# EAGLE design gcsc_ii (EAGLE 6.6.0)
DATABASE: C:\projects\common\EagleCad\ulp\PARTSDB.txt
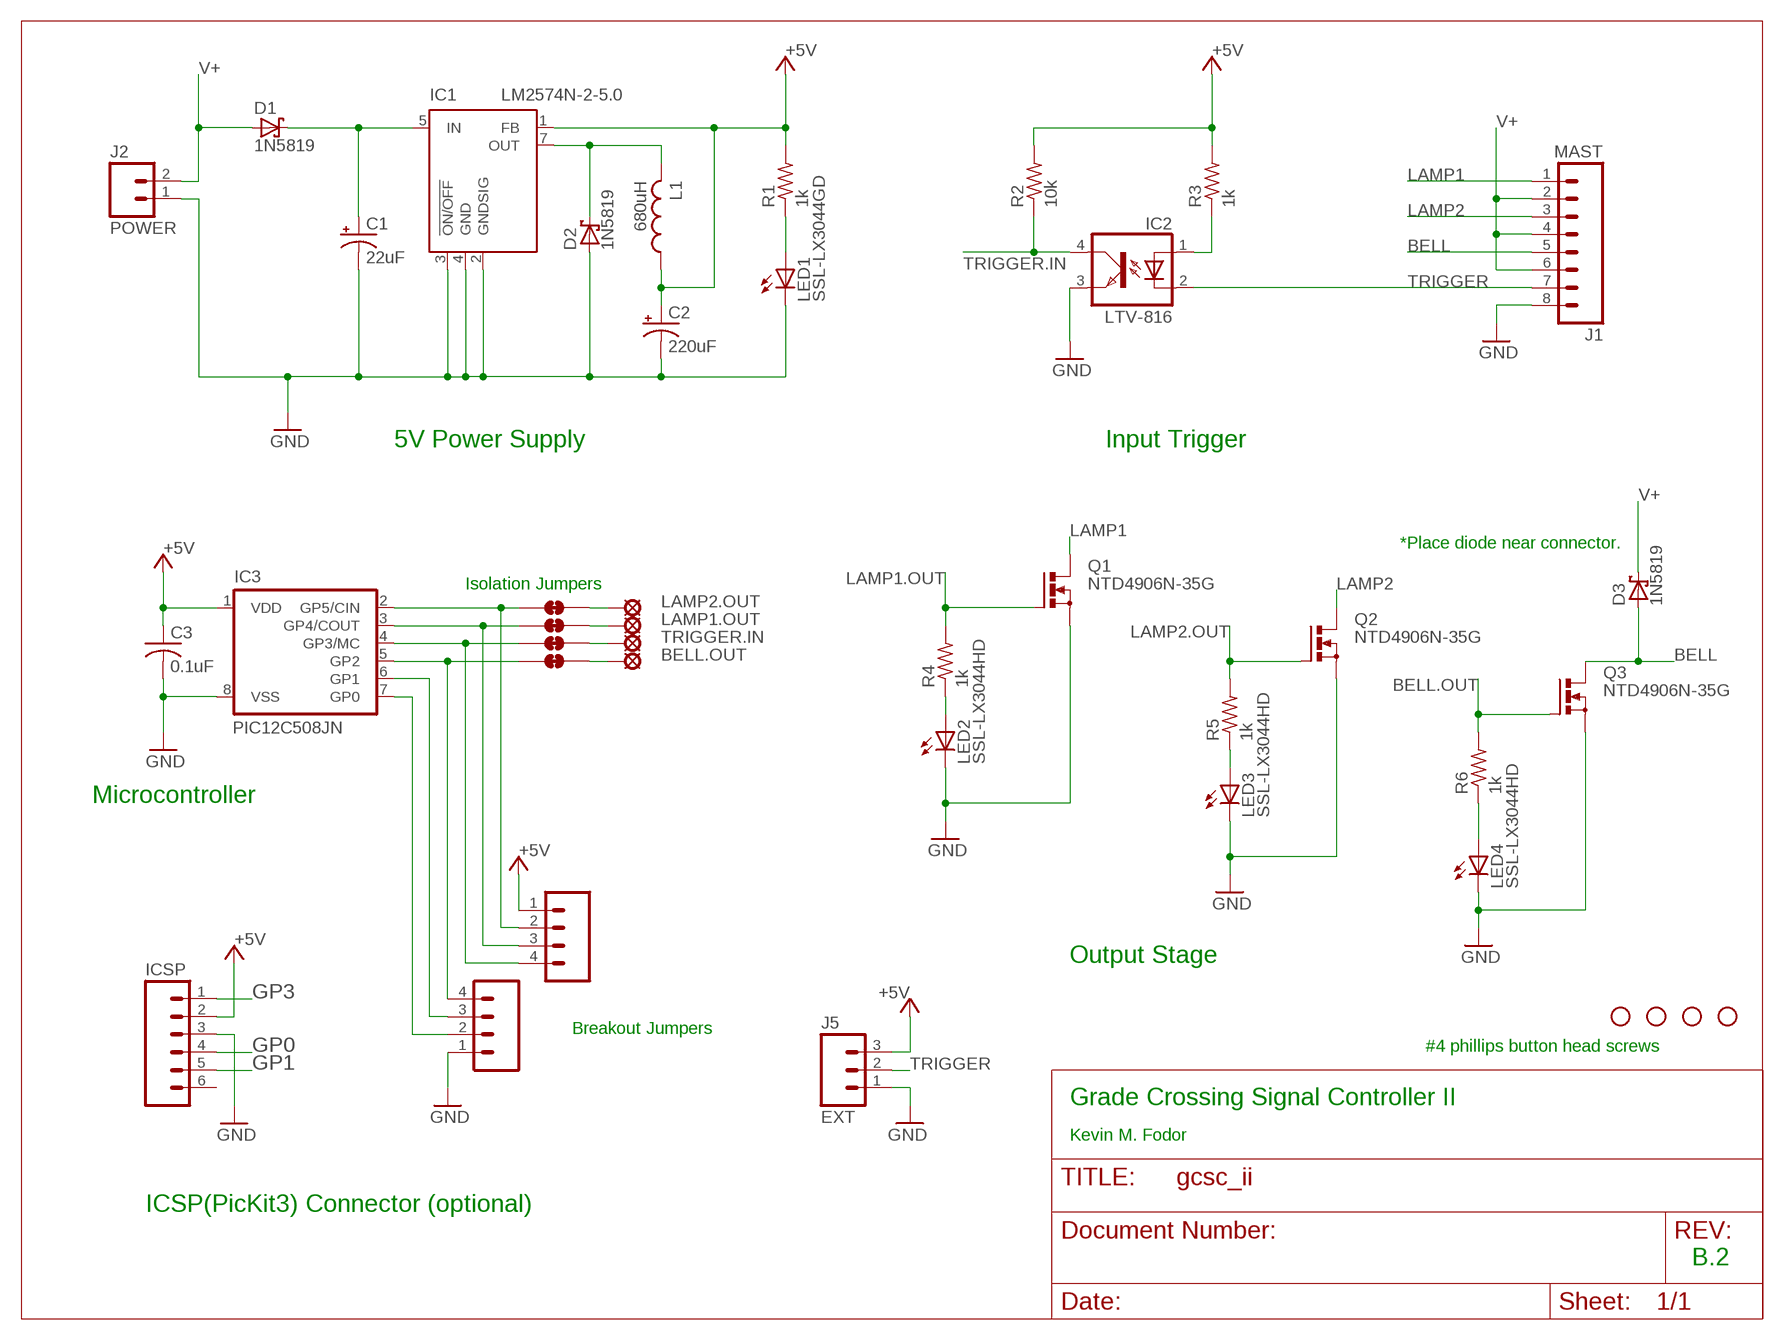
[diagram p0: schematic, sheet 1]

## Parts
BELL.OUT  BELL  LSP10  [LSP10]
C1  22uF  CPOL-USFR-5  [E2-5]
C2  220uF  CPOL-USFR-6,3  [E2,5-6,3]
C3  0.1uF  C-USC025-024X044  [C025-024X044]
D1  1N5819  SCHOTTKY-DIODEDO41  [DO41-10]
D2  1N5819  SCHOTTKY-DIODEDO41  [DO41-10]
D3  1N5819  SCHOTTKY-DIODEDO41  [DO41-10]
GP2  GP2  SJ_CLOSED  [SJ_2S-TRACE]
GP3  GP3  SJ_CLOSED  [SJ_2S-TRACE]
GP4  GP4  SJ_CLOSED  [SJ_2S-TRACE]
GP5  GP5  SJ_CLOSED  [SJ_2S-TRACE]
IC1  LM2574N-2-5.0  [DIL8]
IC2  LTV-816  LTV816  [DIL04]
IC3  PIC12C508JN  [DIL8]
ICSP  PIC_ICSP_RA  [PIC_ICSP]
J1  MAST  KK-156-8-RA  [KK-156-8-RA]
J2  POWER  KK-156-2RA  [KK-156-2-RA]
J3  IC3_1-4  M04LOCK  [1X04_LOCK]
J4  IC3_5-8  M04LOCK  [1X04_LOCK]
J5  EXT  M03POLAR_LOCK  [MOLEX-1X3_LOCK]
L1  680uH  RLB0608  [RLB0608]
LAMP1.OUT  LAMP1  LSP10  [LSP10]
LAMP2.OUT  LAMP2  LSP10  [LSP10]
LED1  SSL-LX3044GD  LED3MM  [LED3MM]
LED2  SSL-LX3044HD  LED3MM  [LED3MM]
LED3  SSL-LX3044HD  LED3MM  [LED3MM]
LED4  SSL-LX3044HD  LED3MM  [LED3MM]
Q1  NTD4906N-35G  NTD4906N  [I-PAK_STRAIGHT_LEAD]
Q2  NTD4906N-35G  NTD4906N  [I-PAK_STRAIGHT_LEAD]
Q3  NTD4906N-35G  NTD4906N  [I-PAK_STRAIGHT_LEAD]
R1  1k  R-US0207/10  [0207/10]
R2  10k  R-US0207/10  [0207/10]
R3  1k  R-US0207/10  [0207/10]
R4  1k  R-US0207/10  [0207/10]
R5  1k  R-US0207/10  [0207/10]
R6  1k  R-US0207/10  [0207/10]
TRIGGER.IN  TRIGGER  LSP10  [LSP10]
U$1  STAND-OFF  [STAND-OFF]
U$2  STAND-OFF  [STAND-OFF]
U$3  STAND-OFF  [STAND-OFF]
U$4  STAND-OFF  [STAND-OFF]

## Nets
+5V [VCC]: C2.+ C3.1 IC1.1(FB) IC3.1(VDD) ICSP.2(VDD) J3.1 J5.3 L1.1 R1.2 R2.2 R3.2
BELL [BATTERY]: D3.A J1.5 Q3.2(D)
BELL.OUT: BELL.OUT.MP GP2.2 Q3.1(G) R6.2
GND: C1.- C2.- C3.2 D2.A IC1.2(GNDSIG) IC1.3(!ON/OFF) IC1.4(GND) IC2.3(EMIT) IC3.8(VSS) ICSP.3(VSS) J1.8 J2.1 J4.1 J5.1 LED1.K(C) LED2.K(C) LED3.K(C) LED4.K(C) Q1.3(S) Q2.3(S) Q3.3(S)
GP0: IC3.7(GP0) ICSP.4(ICSPDAT) J4.2
GP1: IC3.6(GP1) ICSP.5(ICSPCLK) J4.3
GP2: GP2.1 IC3.5(GP2) J4.4
GP3: GP3.1 IC3.4(GP3/MC) ICSP.1(!MCLR) J3.4
GP4: GP4.1 IC3.3(GP4/COUT) J3.3
GP5: GP5.1 IC3.2(GP5/CIN) J3.2
LAMP1 [BATTERY]: J1.1 Q1.2(D)
LAMP1.OUT: GP4.2 LAMP1.OUT.MP Q1.1(G) R4.2
LAMP2 [BATTERY]: J1.3 Q2.2(D)
LAMP2.OUT: GP5.2 LAMP2.OUT.MP Q2.1(G) R5.2
N$1: IC2.1(A) R3.1
N$2: LED1.A R1.1
N$3 [VCC]: C1.+ D1.C IC1.5(IN)
N$4 [VCC]: D2.C IC1.7(OUT) L1.2
N$5: LED2.A R4.1
N$6: LED3.A R5.1
N$7: LED4.A R6.1
TRIGGER: IC2.2(C) J1.7 J5.2
TRIGGER.IN: GP3.2 IC2.4(COL) R2.1 TRIGGER.IN.MP
V+ [BATTERY]: D1.A D3.C J1.2 J1.4 J1.6 J2.2
Unconnected: ICSP.6(NC)

## Notes on the sheet
- 5V Power Supply | Input Trigger
- *Place diode near connector.
- Isolation Jumpers
- Microcontroller
- Output Stage
- Breakout Jumpers
- #4 phillips button head screws
- Grade Crossing Signal Controller II
- Kevin M. Fodor
- ICSP(PicKit3) Connector (optional)
- B.2

## Library data of the parts
BELL.OUT LAMP1.OUT LAMP2.OUT TRIGGER.IN = kevin:LSP10: SOLDER PAD drill 1.0 mm, distributor Buerklin, 12H555; BOM: EXCLUDE; DNP: T; PARTNO: 22-28-4012
C1 = kevin:CPOL-US: POLARIZED CAPACITOR, American symbol; PARTNO: EEU-FR1H220
C2 = kevin:CPOL-US: POLARIZED CAPACITOR, American symbol; PARTNO: EEU-FR1C221
C3 = kevin:C-US: CAPACITOR, American symbol; PARTNO: 21RZ310-RC
D1-D3 = kevin:SCHOTTKY-DIODE: Schottky Diode; PARTNO: 1N5819
GP2-GP5 = kevin:SJ_CLOSED: Jumper - CLOSED; BOM: EXCLUDE; DNP: T
IC1 = kevin:LM2574?-*: SIMPLE SWITCHER 0.5A Step-Down Voltage Regulator Source: http://cache.national.com/ds/LM/LM2574.pdf; PARTNO: LM2574N-5G
IC2 = kevin:LTV816: OPTO COUPLER Source: LITEON, LTV816.pdf; OC_FARNELL: unknown; OC_NEWARK: unknown; PARTNO: LTV-816
IC3 = kevin:PIC12C*?: MICROCONTROLLER; MF: MICROCHIP; MPN: PIC12C508-04/P; OC_FARNELL: 9758771; OC_NEWARK: 60K6710; PARTNO: PIC12F508-I/P
ICSP = kevin:PIC_ICSP: Microchip PicKit3 ICSP/ICD Header; BOM: EXCLUDE; DNP: T; PARTNO: 68016-106HLF
J1 = kevin:KK-156-8: KK 156 HEADER Molex 26-60-5080 Source: http://www.molex.com/pdm_docs/sd/026604100_sd.pdf; PARTNO: 26-60-5080
J2 = kevin:KK-156-2: KK 156 HEADER Source: http://www.molex.com/pdm_docs/sd/026604100_sd.pdf; PARTNO: 26-60-5020
J3 J4 = kevin:M04: Header 4 Standard 4-pin 0.1" header. Use with straight break away headers (SKU : PRT-00116), right angle break away headers (PRT-00553), swiss pins (PRT-00743), machine pins (PRT-00117), and female headers (PRT-00115). Molex polarized connector foot print use with SKU : PRT-08231 with associated crimp pins and housings.; BOM: EXCLUDE; DNP: T; PARTNO: 22-28-4042
J5 = kevin:M03: Header 3 Standard 3-pin 0.1" header. Use with straight break away headers (SKU : PRT-00116), right angle break away headers (PRT-00553), swiss pins (PRT-00743), machine pins (PRT-00117), and female headers (PRT-00115). Molex polarized connector foot print use with SKU : PRT-08232 with associated crimp pins and housings.; BOM: INCLUDE; DNP: F; PARTNO: 22-27-2031
L1 = kevin:RLB0608; PARTNO: RLB0608-681KL
LED1 = kevin:LED: LED OSRAM: - CHIPLED LG R971, LG N971, LY N971, LG Q971, LY Q971, LO R971, LY R971 LH N974, LH R974 LS Q976, LO Q976, LY Q976 LO Q996 - Hyper CHIPLED LW Q18S LB Q993, LB Q99A, LB R99A - SideLED LS A670, LO A670, LY A670, LG A670, LP A670 LB A673, LV A673, LT A673, LW A673 LH A674 LY A675 LS A676, LA A676, LO A676, LY A676, LW A676 LS A679, LY A679, LG A679 - Hyper Micro SIDELED® LS Y876, LA Y876, LO Y876, LY Y876 LT Y87S - SmartLED LW L88C, LW L88S LB L89C, LB L89S, LG L890 LS L89K, LO L89K, LY L89K LS L896, LA L896, LO L896, LY L896 - TOPLED LS T670, LO T670, LY T670, LG T670, LP T670 LSG T670, LSP T670, LSY T670, LOP T670, LYG T670 LG T671, LOG T671, LSG T671 LB T673, LV T673, LT T673, LW T673 LH T674 LS T676, LA T676, LO T676, LY T676, LB T676, LH T676, LSB T676, LW T676 LB T67C, LV T67C, LT T67C, LS T67K, LO T67K, LY T67K, LW E67C LS E67B, LA E67B, LO E67B, LY E67B, LB E67C, LV E67C, LT E67C LW T67C LS T679, LY T679, LG T679 LS T770, LO T770, LY T770, LG T770, LP T770 LB T773, LV T773, LT T773, LW T773 LH T774 LS E675, LA E675, LY E675, LS T675 LS T776, LA T776, LO T776, LY T776, LB T776 LHGB T686 LT T68C, LB T68C - Hyper Mini TOPLED® LB M676 - Mini TOPLED Santana® LG M470 LS M47K, LO M47K, LY M47K Source: http://www.osram.convergy.de/; PARTNO: SSL-LX3044GD
LED2-LED4 = kevin:LED: LED OSRAM: - CHIPLED LG R971, LG N971, LY N971, LG Q971, LY Q971, LO R971, LY R971 LH N974, LH R974 LS Q976, LO Q976, LY Q976 LO Q996 - Hyper CHIPLED LW Q18S LB Q993, LB Q99A, LB R99A - SideLED LS A670, LO A670, LY A670, LG A670, LP A670 LB A673, LV A673, LT A673, LW A673 LH A674 LY A675 LS A676, LA A676, LO A676, LY A676, LW A676 LS A679, LY A679, LG A679 - Hyper Micro SIDELED® LS Y876, LA Y876, LO Y876, LY Y876 LT Y87S - SmartLED LW L88C, LW L88S LB L89C, LB L89S, LG L890 LS L89K, LO L89K, LY L89K LS L896, LA L896, LO L896, LY L896 - TOPLED LS T670, LO T670, LY T670, LG T670, LP T670 LSG T670, LSP T670, LSY T670, LOP T670, LYG T670 LG T671, LOG T671, LSG T671 LB T673, LV T673, LT T673, LW T673 LH T674 LS T676, LA T676, LO T676, LY T676, LB T676, LH T676, LSB T676, LW T676 LB T67C, LV T67C, LT T67C, LS T67K, LO T67K, LY T67K, LW E67C LS E67B, LA E67B, LO E67B, LY E67B, LB E67C, LV E67C, LT E67C LW T67C LS T679, LY T679, LG T679 LS T770, LO T770, LY T770, LG T770, LP T770 LB T773, LV T773, LT T773, LW T773 LH T774 LS E675, LA E675, LY E675, LS T675 LS T776, LA T776, LO T776, LY T776, LB T776 LHGB T686 LT T68C, LB T68C - Hyper Mini TOPLED® LB M676 - Mini TOPLED Santana® LG M470 LS M47K, LO M47K, LY M47K Source: http://www.osram.convergy.de/; PARTNO: SSL-LX3044HD
Q1-Q3 = kevin:NTD4906N: N-CHANNEL MOS FET; PARTNO: NTD4906N-35G
R1 R3-R6 = kevin:R-US; PARTNO: 299-1K-RC
R2 = kevin:R-US; PARTNO: 299-10K-RC
U$1-U$4 = kevin:STAND-OFF: Stand Off This is the mechanical footprint for a #4 phillips button head screw. Use the keepout ring to avoid running the screw head into surrounding components. SKU : PRT-00447; BOM: EXCLUDE

## Net classes
0 default: width 0.203 mm, clearance 0.203 mm
1 VCC: width 0.508 mm, clearance 0.203 mm
2 BATTERY: width 1.27 mm, clearance 0.508 mm

## Board
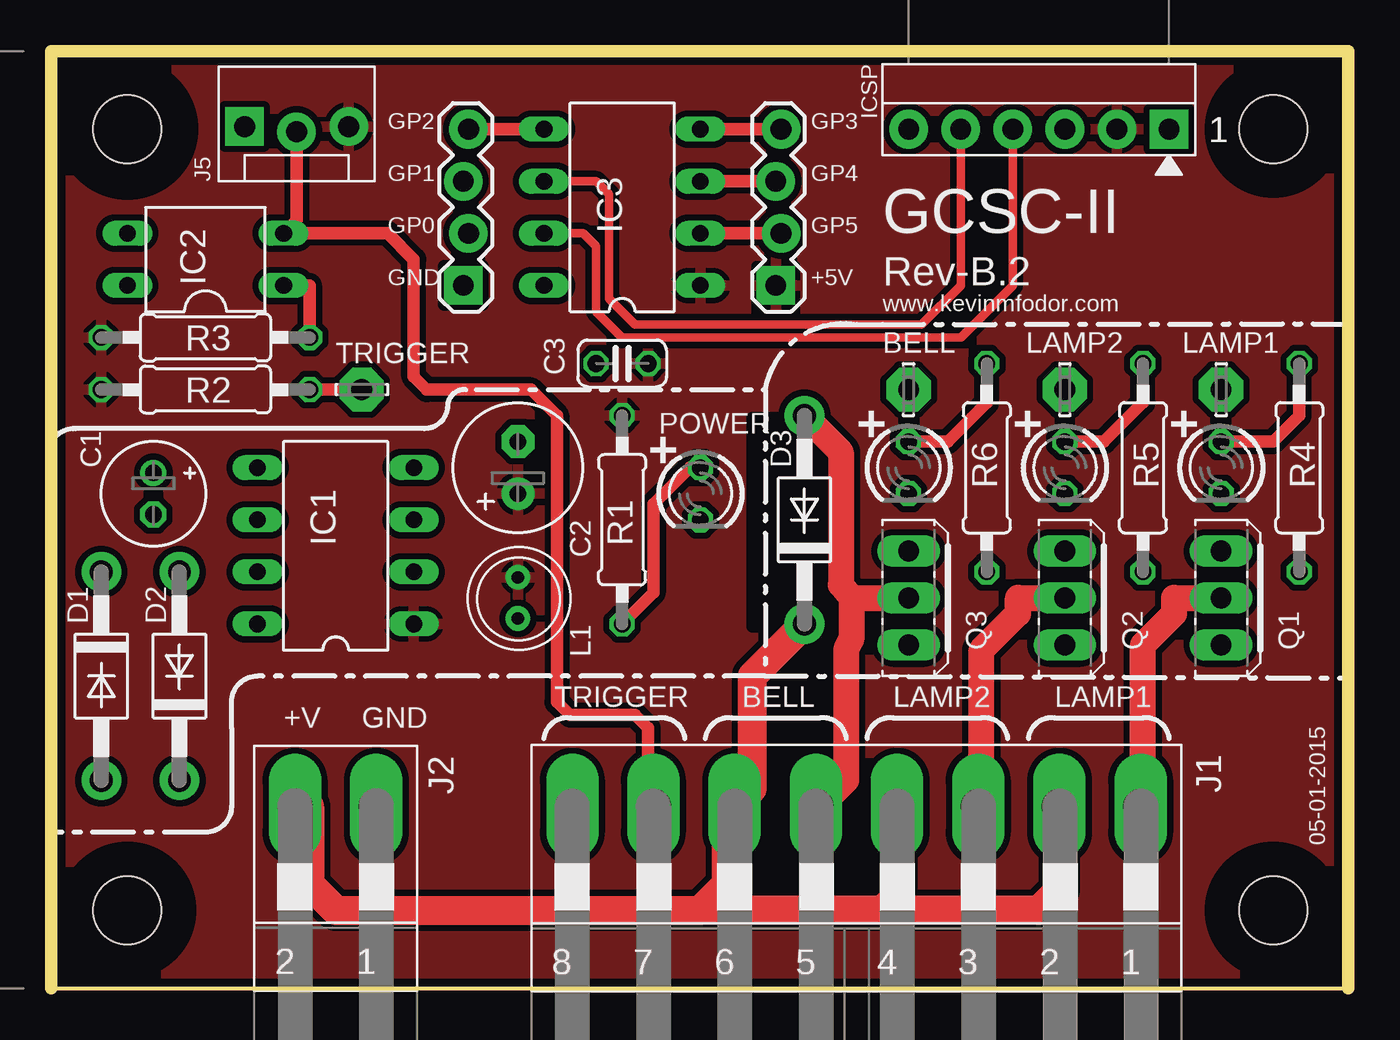
[diagram p1: board, top side]
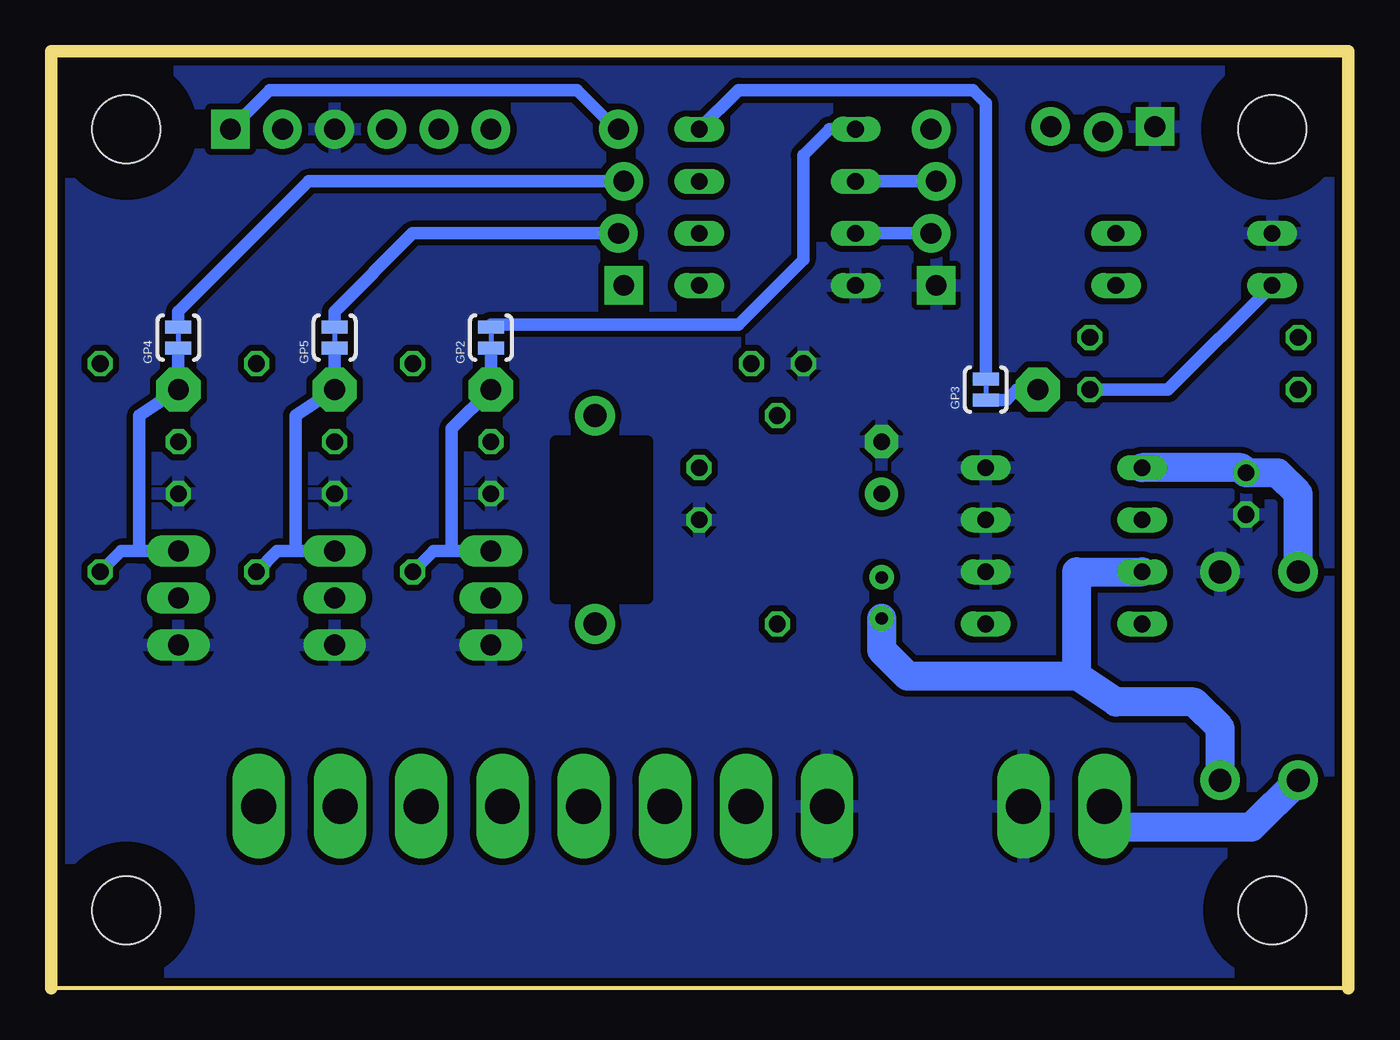
[diagram p2: board, bottom side, seen from below]

Size 63.25 x 45.71 mm. Coordinates in mm from the lower left corner, seen from the top.
Outline: 0,0 63.25,0 63.25,45.71 0,45.71 0,0
Copper layers (1*16): Top 0.0356mm / dielectric 1.5011mm / Bottom 0.0356mm
Design rules "LaenPCBOrder": minimum track width 6mil, minimum drill 13mil, track to track 6mil, track to pad 6mil, pad to pad 6mil, via to via 6mil, smd to smd 6mil, copper to edge 15mil, drill to drill 6mil, minimum pad ring 7mil, minimum via ring 7mil, stop-mask expansion 4mil, vias tented up to drill 0mil, thermal gap 10mil
tRestrict: area 0.9,1 to 6.5,6.6; area 56.7,39.1 to 62.4,44.7; area 56.7,1 to 62.4,6.6; area 0.9,39.1 to 6.5,44.7; area 35.2,18.8 to 37.4,26.3; area 34.2,17.7 to 35.2,27.8
bRestrict: area 56.7,39.1 to 62.4,44.7; area 56.7,1 to 62.4,6.6; area 0.9,1 to 6.5,6.6; area 0.9,39.1 to 6.5,44.7; area 34.2,19 to 38.6,26.7

### Footprints (pad centres in the part's own frame; a part is rotated, then mirrored left to right if it is on the bottom)
LSP10 = drill 1.016 pad 2.159 octagon: MP 0,0
E2-5 = drill 0.813 pad 1.27: + -1.016,0 | drill 0.813 pad 1.27 octagon: - 1.016,0
E2,5-6,3 = drill 0.813 pad 1.6: + -1.27,0 | drill 0.813 pad 1.6 octagon: - 1.27,0
C025-024X044 = drill 0.813 octagon: 1 -1.27,0; 2 1.27,0
DO41-10 = drill 1.118 pad 1.93: A 5.08,0; C -5.08,0
SJ_2S-TRACE = smd 0.635 x 1.27: 1 -0.508,0; 2 0.508,0
DIL8 = drill 0.813 long: 1 -3.81,-3.81; 2 -1.27,-3.81; 3 1.27,-3.81; 4 3.81,-3.81; 5 3.81,3.81; 6 1.27,3.81; 7 -1.27,3.81; 8 -3.81,3.81
DIL04 = drill 0.813 long: 1 -1.27,-3.81; 2 1.27,-3.81; 3 1.27,3.81; 4 -1.27,3.81
PIC_ICSP = drill 1.016 pad 1.88 square: 1 12.7,0 | drill 1.016 pad 1.88: 2 10.16,0; 3 7.62,0; 4 5.08,0; 5 2.54,0; 6 0,0
KK-156-8-RA = drill 1.7 long: 1 -13.86,0; 2 -9.9,0; 3 -5.94,0; 4 -1.98,0; 5 1.98,0; 6 5.94,0; 7 9.9,0; 8 13.86,0
KK-156-2-RA = drill 1.7 long: 1 -1.98,0; 2 1.98,0
1X04_LOCK = drill 1.016 pad 1.88 square: 1 0,0.127 | drill 1.016 pad 1.88: 2 2.54,-0.127; 3 5.08,0.127; 4 7.62,-0.127
MOLEX-1X3_LOCK = drill 1.016 pad 1.88 square: 1 0,0.127 | drill 1.016 pad 1.88: 2 2.54,-0.127; 3 5.08,0.127
RLB0608 = drill 0.6 pad 1.2: 1 -1,0; 2 1,0
LED3MM = drill 0.813 octagon: A -1.27,0; K 1.27,0
I-PAK_STRAIGHT_LEAD = drill 1.016 long: 1 -2.286,0; 2 0,0; 3 2.286,0
0207/10 = drill 0.813 octagon: 1 -5.08,0; 2 5.08,0
STAND-OFF = hole 3.302: 0,0

### Placement (x,y rotation side)
BELL.OUT  41.81,29.21 90 top
C1  4.98,24.13 270 top
C2  22.76,25.4 90 top
C3  27.84,30.48 180 top
D1  2.44,15.24 270 top
D2  6.25,15.24 90 top
D3  36.73,22.86 90 top
GP2  41.81,31.75 270 bottom
GP3  17.68,29.21 270 bottom
GP4  57.05,31.75 270 bottom
GP5  49.43,31.75 270 bottom
IC1  13.87,21.59 90 top
IC2  7.52,35.56 90 top
IC3  27.84,38.1 90 top
ICSP  41.81,41.91 0 top
J1  39.27,8.89 180 top
J2  13.87,8.89 180 top
J3  35.46,34.29 90 top
J4  20.22,34.29 90 top
J5  9.42,41.91 0 top
L1  22.76,19.05 270 top
LAMP1.OUT  57.05,29.21 90 top
LAMP2.OUT  49.43,29.21 90 top
LED1  31.65,24.13 270 top
LED2  57.05,25.4 270 top
LED3  49.43,25.4 270 top
LED4  41.81,25.4 270 top
Q1  57.05,19.05 270 top
Q2  49.43,19.05 270 top
Q3  41.81,19.05 270 top
R1  27.84,22.86 90 top
R2  7.52,29.21 180 top
R3  7.52,31.75 180 top
R4  60.86,25.4 270 top
R5  53.24,25.4 270 top
R6  45.62,25.4 270 top
TRIGGER.IN  15.14,29.21 0 top
U$1  3.71,41.91 0 top
U$2  59.59,3.81 0 top
U$3  3.71,3.81 0 top
U$4  59.59,41.91 0 top

### Tracks (layer width: path | path; a pad name or v marks a point on that pad's centre or on a via)
+5V
  pour Top (isolate 0.305): -0.1,0 -0.1,45.72 63.4,45.72 63.4,0
BELL
  Top 1.27: 39.01,19.05 38.51,19.68 38.51,26.16 D3.A | 39.01,19.05 Q3.2 | 39.01,19.05 39.01,17.02 38.76,16.51 38.76,10.16 37.49,8.89 J1.5
BELL.OUT
  Bottom 0.61: GP2.2 BELL.OUT.MP 43.71,27.3 43.71,21.34 | R6.2 44.6,21.34 43.71,21.34 | 43.71,21.34 Q3.1
GND
  pour Bottom (isolate 0.305): -0.1,0 -0.1,45.72 63.4,45.72 63.4,0
GP0
  Top 0.406: ICSP.4 46.89,34.29 44.35,31.75 27.84,31.75 26.57,33.02 26.57,36.2 25.93,36.83 IC3.7
  Bottom 0.61: J4.2 IC3.7
GP1
  Top 0.406: ICSP.5 44.35,34.29 42.44,32.38 28.47,32.38 27.2,33.66 27.2,38.73 26.57,39.37 IC3.6
  Bottom 0.61: J4.3 IC3.6
GP2
  Top 0.61: IC3.5 J4.4
  Bottom 0.61: GP2.1 41.81,32.38 29.74,32.38 26.57,35.56 26.57,40.64 25.3,41.91 IC3.5
GP3
  Top 0.203: 35.46,41.91 J3.4
  Top 0.61: IC3.4 35.46,41.91
  Bottom 0.61: GP3.1 17.68,43.18 18.31,43.81 29.74,43.81 IC3.4 | ICSP.1 52.6,43.81 37.62,43.81 35.71,41.91 J3.4
GP4
  Top 0.203: 35.2,39.37 J3.3
  Top 0.61: 35.2,39.37 IC3.3
  Bottom 0.61: GP4.1 57.05,33.02 50.7,39.37 35.46,39.37 J3.3
GP5
  Top 0.203: 35.46,36.83 J3.2
  Top 0.61: 35.46,36.83 IC3.2
  Bottom 0.61: J3.2 45.62,36.83 49.43,33.02 GP5.1
LAMP1
  Top 1.27: Q1.2 54.76,19.05 54.76,18.29 53.24,16.76 53.24,8.89 J1.1
LAMP1.OUT
  Bottom 0.61: GP4.2 LAMP1.OUT.MP 58.95,27.94 58.95,21.34 | R4.2 59.84,21.34 58.95,21.34 | 58.95,21.34 Q1.1
LAMP2
  Top 1.27: Q2.2 47.14,19.05 47.14,18.29 45.36,16.51 45.36,8.89 J1.3
LAMP2.OUT
  Bottom 0.61: R5.2 52.22,21.34 51.33,21.34 | Q2.1 51.33,21.34 | 51.33,21.34 51.33,27.94 LAMP2.OUT.MP GP5.2
N$1
  Top 0.61: IC2.1 12.6,34.29 R3.1
N$2
  Top 0.61: R1.1 29.36,19.3 29.36,23.62 31.14,25.4 LED1.A
N$3
  Bottom 1.422: D1.C 2.44,22.86 2.44,24.13 3.45,25.15 C1.+ 5.23,25.4 IC1.5
N$4
  Bottom 1.422: L1.2 22.76,16.51 21.49,15.24 13.23,15.24 | 13.23,15.24 13.23,20.32 IC1.7 | D2.C 6.25,12.7 7.52,13.97 11.33,13.97 13.23,15.24
N$5
  Top 0.61: LED2.A 59.59,26.67 60.86,27.94 R4.1
N$6
  Top 0.61: LED3.A 51.33,26.67 53.24,28.57 R5.1
N$7
  Top 0.61: LED4.A 43.71,26.67 45.62,28.57 R6.1
TRIGGER
  Top 0.61: J5.2 11.96,37.47 IC2.2 16.41,36.83 17.68,35.56 17.68,29.84 18.31,29.21 23.39,29.21 24.66,27.94 24.66,13.97 25.3,13.34 28.47,13.34 29.11,12.7 29.11,9.53 J1.7
TRIGGER.IN
  Top 0.61: R2.1 TRIGGER.IN.MP
  Bottom 0.61: GP3.2 16.66,28.7 16.15,29.21 TRIGGER.IN.MP | IC2.4 8.79,29.21 R2.1
V+
  Top 1.422: J2.2 12.6,8.89 12.6,6.35 12.6,5.08 13.87,3.81 31.65,3.81 | 31.65,3.81 32.92,5.08 32.92,8.48 J1.6 34.19,9.75 34.19,15.24 D3.C | J1.4 41.25,4.52 40.54,3.81 | 40.54,3.81 31.65,3.81 | J1.2 49.17,4.82 48.16,3.81 40.54,3.81
  Bottom 1.27: 10.82,7.87 11.84,8.89 J2.2
  Bottom 1.422: D1.A 4.72,7.87 10.82,7.87

### Text on the board
tPlace: GP2 | GP3 | J5 | GP1 | GP4 | GP0 | GP5 | GCSC-II | GND | +5V | Rev-B.2 | www.kevinmfodor.com | BELL | LAMP2 | LAMP1 | TRIGGER | POWER | + | + | + | + | TRIGGER | BELL | LAMP2 | LAMP1 | +V | GND | 05-01-2015